# EAGLE board Accumulator Control Unit rev4 (EAGLE 9.6.2)
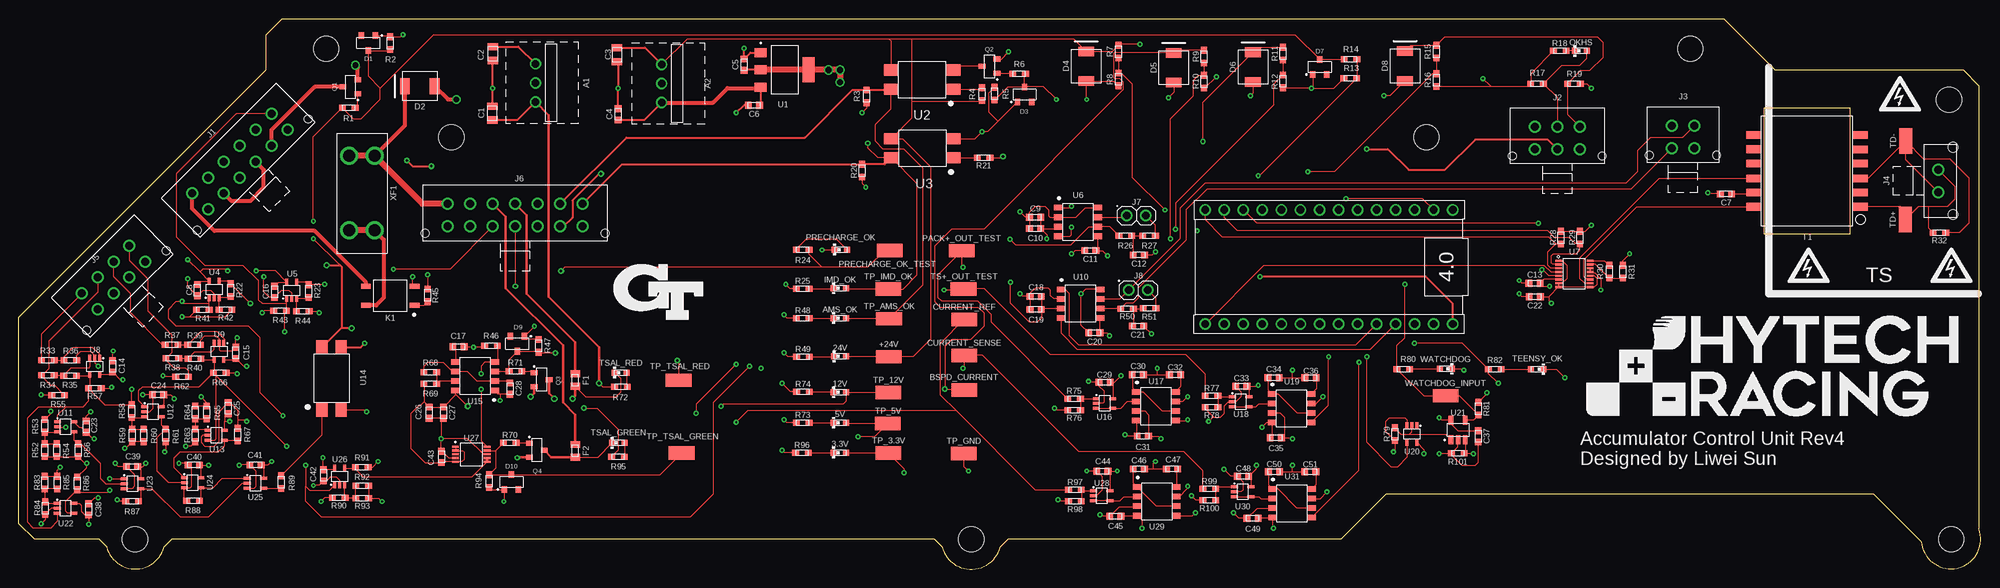
[diagram p6: board, top side]
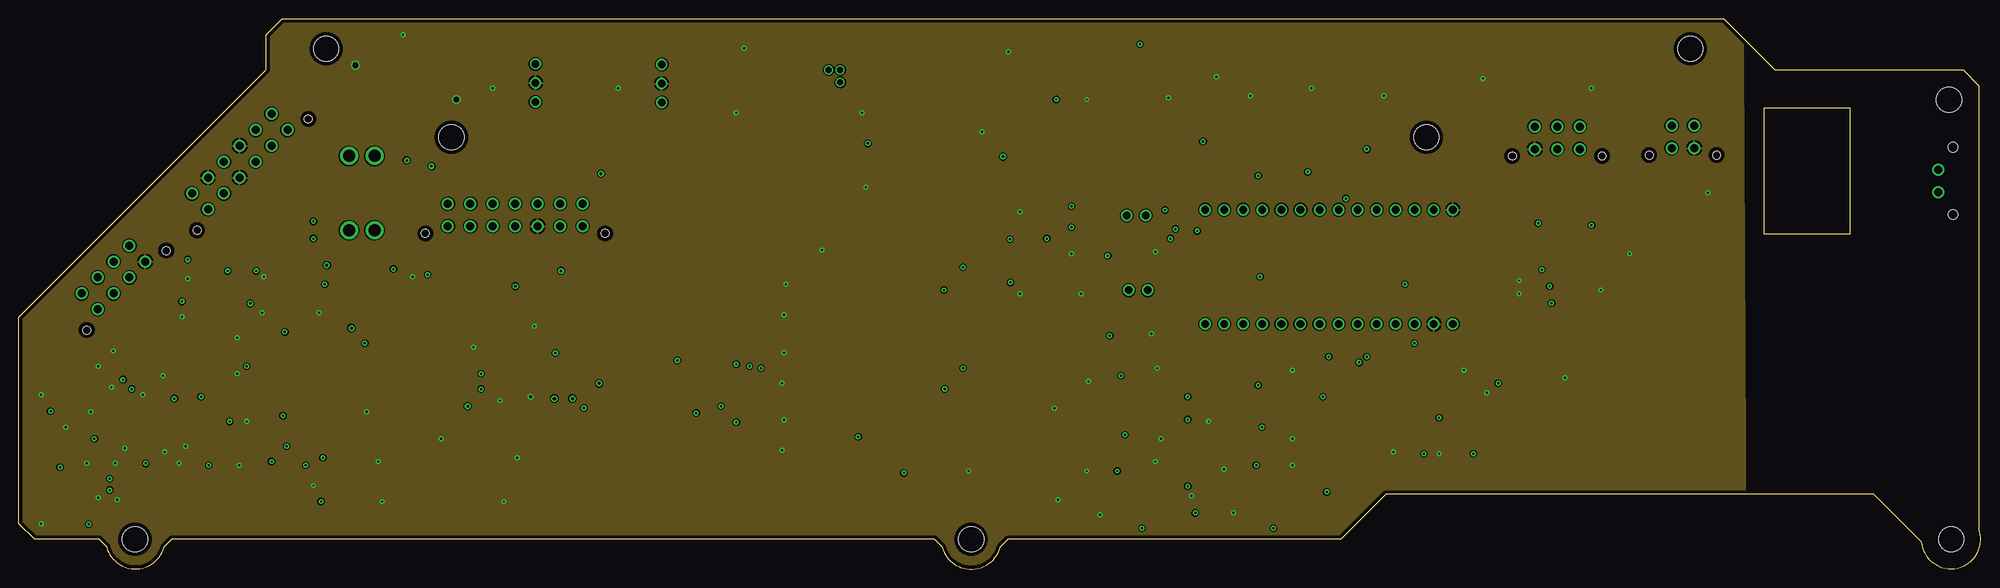
[diagram p7: board, inner layer GND]
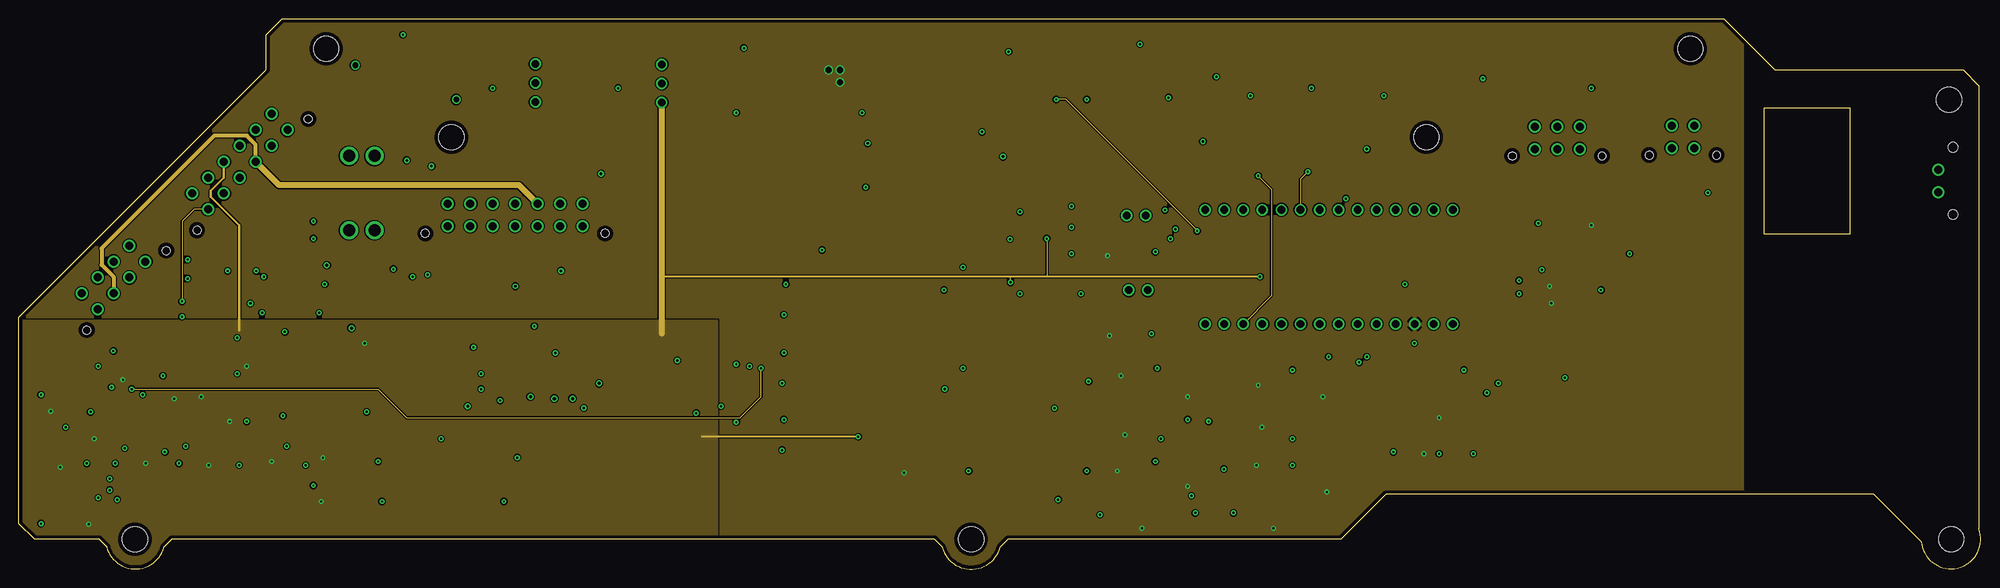
[diagram p8: board, inner layer +3V3+5V]
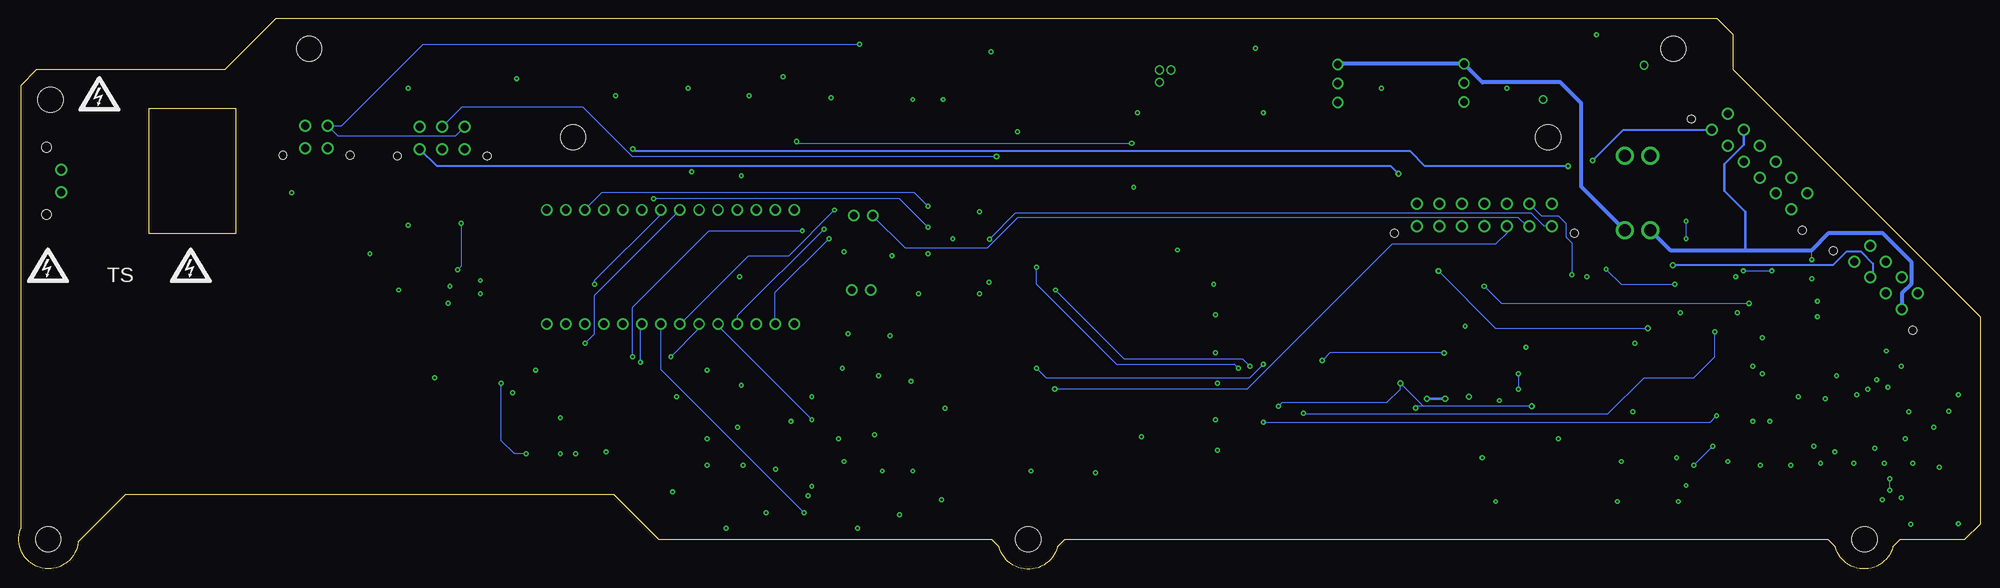
[diagram p9: board, bottom side, seen from below]

Size 261.63 x 73.39 mm. Coordinates in mm from the lower left corner, seen from the top.
Outline: 35.1,73.39 227.4,73.39 234.2,66.59 259.3,66.59 261.4,64.49 261.4,5.39 arc-195 253.7,3.69 247.4,9.99 182.3,9.99 176.3,3.99 131.9,3.99 130.9,2.99 arc-150 123.1,2.99 122.1,3.99 20.4,3.99 19.4,2.99 arc-150 11.7,2.99 10.7,3.99 2.1,3.99 0,6.09 0,33.59 33,66.59 33,71.29 35.1,73.39
Copper layers (1+2*15+16): Top 0.035mm / dielectric 0.2mm / GND 0.0175mm / dielectric 1.065mm / +3V3+5V 0.0175mm / dielectric 0.2mm / Bottom 0.035mm
Design rules "HyTech Default (4 Layer)": minimum track width 6mil, minimum drill 10mil, track to track 6mil, track to pad 6mil, pad to pad 6mil, via to via 20mil, smd to smd 6mil, copper to edge 20mil, drill to drill 21mil, minimum pad ring 8mil, minimum via ring 8mil, stop-mask expansion 3mil, vias tented up to drill 30mil, thermal gap 10mil

## Footprints (pad centres in the part's own frame; a part is rotated, then mirrored left to right if it is on the bottom)
0603-LED = smd 0.8 x 0.8: 1 -0.825,0; 2 0.825,0
OKI-78SR = drill 0.991: 1 -2.54,0; 2 0,0; 3 2.54,0
TEENSY_SHORT = drill 1.016: 3.3V 0,5.08; AGND/GND 0,2.54; D0 15.24,2.54; D1 15.24,5.08; D2 15.24,7.62; D3 15.24,10.16; D4 15.24,12.7; D5 15.24,15.24; D6 15.24,17.78; D7 15.24,20.32; D8 15.24,22.86; D9 15.24,25.4; D10 15.24,27.94; D11 15.24,30.48; D12 15.24,33.02; D13 0,33.02; D14 0,30.48; D15 0,27.94; D16 0,25.4; D17 0,22.86; D18 0,20.32; D19 0,17.78; D20 0,15.24; D21 0,12.7; D22 0,10.16; D23 0,7.62; GND 15.24,0; VIN 0,0
MICRO_MINIATURE = smd 3.429 x 1.778: 1 0,0
0805-CAP = smd 0.95 x 1.4: 1 -0.925,0; 2 0.925,0
0603-CAP = smd 0.9 x 0.9: 1 -0.75,0; 2 0.75,0
SOT-23 = smd 0.711 x 0.889: 1 -0.94,-1.003; 2 0.94,-1.003; 3 0,1.003
DO-214AA = smd 1.27 x 2.1: 1 -1.98,0; 2 1.98,0
0603-FUSE = smd 0.914 x 1.27: 1 -0.838,0; 2 0.838,0
MOLEX_MICROFIT_PTH_VERTICAL_12_DUAL = drill 1.067: 1 7.493,-2.997; 2 4.496,-2.997; 3 1.499,-2.997; 4 -1.499,-2.997; 5 -4.496,-2.997; 6 -7.493,-2.997; 7 7.493,0; 8 4.496,0; 9 1.499,0; 10 -1.499,0; 11 -4.496,0; 12 -7.493,0 | hole 1.067: 10.49,0.94; -10.49,0.94
MOLEX_MICROFIT_PTH_VERTICAL_06_DUAL = drill 1.067: 1 2.997,-2.997; 2 0,-2.997; 3 -2.997,-2.997; 4 2.997,0; 5 0,0; 6 -2.997,0 | hole 1.067: 5.994,0.94; -5.994,0.94
MOLEX_MICROFIT_PTH_VERTICAL_04_DUAL = drill 1.067: 1 1.499,-2.997; 2 -1.499,-2.997; 3 1.499,0; 4 -1.499,0 | hole 1.067: 4.496,0.94; -4.496,0.94
MOLEX_MICROFIT_PTH_VERTICAL_02_SINGLE = drill 1.067: 1 1.499,0; 2 -1.499,0 | hole 1.321: 4.496,-1.956; -4.496,-1.956
MOLEX_MICROFIT_PTH_VERTICAL_08_DUAL = drill 1.067: 1 4.496,-2.997; 2 1.499,-2.997; 3 -1.499,-2.997; 4 -4.496,-2.997; 5 4.496,0; 6 1.499,0; 7 -1.499,0; 8 -4.496,0 | hole 1.067: 7.493,0.94; -7.493,0.94
MOLEX_MICROFIT_PTH_VERTICAL_14_DUAL = drill 1.067: 1 8.992,-2.997; 2 5.994,-2.997; 3 2.997,-2.997; 4 0,-2.997; 5 -2.997,-2.997; 6 -5.994,-2.997; 7 -8.992,-2.997; 8 8.992,0; 9 5.994,0; 10 2.997,0; 11 0,0; 12 -2.997,0; 13 -5.994,0; 14 -8.992,0 | hole 1.067: 11.989,0.94; -11.989,0.94
1X02 = drill 1.016: 1 -1.27,0; 2 1.27,0
SOP-04 = smd 0.7 x 1.3: 1 -1.27,-3.25; 2 1.27,-3.25; 3 1.27,3.25; 4 -1.27,3.25
0603-RES = smd 0.9 x 0.8: 1 -0.85,0; 2 0.85,0
HM2112ZNLT_AIRGAP = smd 1.02 x 1.89: 1 -4.78,-7.145; 2 -2.89,-7.145; 3 -1,-7.145; 4 1,-7.145; 5 2.875,-7.145; 6 4.78,-7.145; 7 4.78,7.145; 8 2.89,7.145; 9 1,7.145; 10 -1,7.145; 11 -2.89,7.145; 12 -4.78,7.145
5015 = smd 3.429 x 1.778: 1 0,0
SOT-223 = smd 1.2 x 1.6: 1 -2.3,-3.2; 2 0,-3.2; 3 2.3,-3.2 | smd 3.3 x 1.6: 4 0,3.2
DIP-4 = smd 1.5 x 1.9: 1 -1.27,-4.15; 2 1.27,-4.15; 3 -1.27,4.15; 4 1.27,4.15
SC-70-5 = smd 0.4 x 0.9: 1 -0.65,-1.1; 2 0,-1.1; 3 0.65,-1.1; 4 0.65,1.1; 5 -0.65,1.1
SOIC-08(NARROW,0.15") = smd 0.762 x 1.143: 1 -1.905,-2.603; 2 -0.635,-2.603; 3 0.635,-2.603; 4 1.905,-2.603; 5 1.905,2.603; 6 0.635,2.603; 7 -0.635,2.603; 8 -1.905,2.603
MSOP-16 = smd 0.305 x 0.889: 1 -1.75,-2.106; 2 -1.25,-2.106; 3 -0.75,-2.106; 4 -0.25,-2.106; 5 0.25,-2.106; 6 0.75,-2.106; 7 1.25,-2.106; 8 1.75,-2.106; 9 1.75,2.106; 10 1.25,2.106; 11 0.75,2.106; 12 0.25,2.106; 13 -0.25,2.106; 14 -0.75,2.106; 15 -1.25,2.106; 16 -1.75,2.106
SOT-23-5 = smd 0.62 x 1.22: 1 -0.95,-1.31; 2 0,-1.31; 3 0.95,-1.31; 4 0.95,1.31; 5 -0.95,1.31
MSOP-10 = smd 0.305 x 0.889: 1 -1,-2.106; 2 -0.5,-2.106; 3 0,-2.106; 4 0.5,-2.106; 5 1,-2.106; 6 1,2.106; 7 0.5,2.106; 8 0,2.106; 9 -0.5,2.106; 10 -1,2.106
MOUNTING_M3 = hole 3.4: 0,0
3568 = drill 1.6: 1 -4.953,1.702; 2 -4.953,-1.702; 3 4.953,-1.702; 4 4.953,1.702

## Placement (x,y rotation side)
3.3V  LED_0603_GREEN  [0603-LED]  109.51,15.56 0 top
5V  LED_0603_BLUE  [0603-LED]  109.51,19.54 0 top
12V  LED_0603_RED  [0603-LED]  109.51,23.59 0 top
24V  LED_0603_ORANGE  [0603-LED]  109.51,28.37 0 top
A1  VOLTAGE_REGULATOR_MODULE_OKI-78SR_12V  [OKI-78SR]  68.91,64.83 270 top
A2  VOLTAGE_REGULATOR_MODULE_OKI-78SR_5V  [OKI-78SR]  85.74,64.76 270 top
A3  TEENSY_4.0TH  [TEENSY_SHORT]  191.24,32.68 90 top
AMS_OK  LED_0603_GREEN  [0603-LED]  109.51,33.48 0 top
BSPD_CURRENT  TEST_POINT  [MICRO_MINIATURE]  126.08,23.9 0 top
C1  CAPACITOR_0805_50V_10UF  [0805-CAP]  63.13,60.82 90 top
C2  CAPACITOR_0805_50V_10UF  [0805-CAP]  63.23,68.75 270 top
C3  CAPACITOR_0805_50V_10UF  [0805-CAP]  79.79,68.6 270 top
C4  CAPACITOR_0603_25V_10UF  [0603-CAP]  79.91,60.63 90 top
C5  CAPACITOR_0603_10V_4.7UF  [0603-CAP]  96.7,67.26 90 top
C6  CAPACITOR_0603_10V_1UF  [0603-CAP]  98.03,61.85 180 top
C7  CAPACITOR_0603_10V_10NF  [0603-CAP]  227.66,50.04 180 top
C8  CAPACITOR_0603_50V_0.1UF  [0603-CAP]  23.83,37.2 270 top
C9  CAPACITOR_0603_10V_1UF  [0603-CAP]  135.53,46.94 0 top
C10  CAPACITOR_0603_10V_0.1UF  [0603-CAP]  135.53,45.41 0 top
C11  CAPACITOR_0603_10V_0.1UF  [0603-CAP]  142.9,42.49 0 top
C12  CAPACITOR_0603_10V_4.7NF  [0603-CAP]  149.35,41.9 180 top
C13  CAPACITOR_0603_10V_10NF  [0603-CAP]  202.13,38.11 0 top
C14  CAPACITOR_0603_10V_0.1UF  [0603-CAP]  12.51,27.05 90 top
C15  CAPACITOR_0603_10V_0.1UF  [0603-CAP]  28.95,28.86 90 top
C16  CAPACITOR_0603_50V_0.1UF  [0603-CAP]  34.1,36.99 270 top
C17  CAPACITOR_0603_10V_10NF  [0603-CAP]  58.63,29.66 0 top
C18  CAPACITOR_0603_10V_1UF  [0603-CAP]  135.61,36.36 0 top
C19  CAPACITOR_0603_10V_0.1UF  [0603-CAP]  135.61,34.64 0 top
C20  CAPACITOR_0603_10V_0.1UF  [0603-CAP]  143.43,31.51 0 top
C21  CAPACITOR_0603_10V_4.7NF  [0603-CAP]  149.25,32.42 180 top
C22  CAPACITOR_0603_10V_0.1UF  [0603-CAP]  202.15,36.32 180 top
C23  CAPACITOR_0603_10V_0.1UF  [0603-CAP]  9,19.02 90 top
C24  CAPACITOR_0603_10V_0.1UF  [0603-CAP]  18.59,23.25 180 top
C25  CAPACITOR_0603_10V_0.1UF  [0603-CAP]  27.93,21.48 90 top
C26  CAPACITOR_0603_25V_0.1UF  [0603-CAP]  54.73,20.87 270 top
C27  CAPACITOR_0603_25V_1UF  [0603-CAP]  56.63,20.87 270 top
C28  CAPACITOR_0603_10V_4.7UF  [0603-CAP]  65.51,24.09 270 top
C29  CAPACITOR_0603_25V_0.1UF  [0603-CAP]  144.79,24.93 180 top
C30  CAPACITOR_0603_10V_0.1UF  [0603-CAP]  149.24,25.92 0 top
C31  CAPACITOR_0603_10V_0.1UF  [0603-CAP]  149.91,17.75 0 top
C32  CAPACITOR_0603_10V_680PF  [0603-CAP]  154.19,25.92 180 top
C33  CAPACITOR_0603_10V_0.1UF  [0603-CAP]  163.02,24.39 180 top
C34  CAPACITOR_0603_10V_0.1UF  [0603-CAP]  167.32,25.51 0 top
C35  CAPACITOR_0603_10V_0.1UF  [0603-CAP]  167.61,17.53 0 top
C36  CAPACITOR_0603_10V_680PF  [0603-CAP]  172.27,25.51 180 top
C37  CAPACITOR_0603_10V_0.1UF  [0603-CAP]  194.61,17.72 90 top
C38  CAPACITOR_0603_10V_0.1UF  [0603-CAP]  9.31,7.97 90 top
C39  CAPACITOR_0603_10V_0.1UF  [0603-CAP]  15.13,13.69 180 top
C40  CAPACITOR_0603_10V_0.1UF  [0603-CAP]  23.36,13.9 180 top
C41  CAPACITOR_0603_10V_0.1UF  [0603-CAP]  31.59,13.9 180 top
C42  CAPACITOR_0603_10V_0.1UF  [0603-CAP]  40.63,12.5 270 top
C43  CAPACITOR_0603_25V_1UF  [0603-CAP]  56.37,14.97 90 top
C44  CAPACITOR_0603_25V_0.1UF  [0603-CAP]  144.5,13.08 180 top
C45  CAPACITOR_0603_10V_0.1UF  [0603-CAP]  146.24,7.05 180 top
C46  CAPACITOR_0603_10V_0.1UF  [0603-CAP]  149.35,13.36 0 top
C47  CAPACITOR_0603_10V_680PF  [0603-CAP]  153.8,13.36 180 top
C48  CAPACITOR_0603_10V_0.1UF  [0603-CAP]  163.27,12.38 180 top
C49  CAPACITOR_0603_10V_0.1UF  [0603-CAP]  164.53,6.79 180 top
C50  CAPACITOR_0603_10V_0.1UF  [0603-CAP]  167.39,12.98 0 top
C51  CAPACITOR_0603_10V_680PF  [0603-CAP]  172.21,12.98 180 top
CURRENT_REF  TEST_POINT  [MICRO_MINIATURE]  126.08,33.3 0 top
CURRENT_SENSE  TEST_POINT  [MICRO_MINIATURE]  126.08,28.51 0 top
D1  TVS__8V  [SOT-23]  46.64,70.15 180 top
D2  TVS_DO-214AA_30V  [DO-214AA]  53.48,64.39 180 top
D3  TVS__8V  [SOT-23]  134.12,63.29 0 top
D4  TVS_DO-214AA_28V  [DO-214AA]  142.34,67.07 90 top
D5  TVS_DO-214AA_28V  [DO-214AA]  154.02,66.87 90 top
D6  TVS_DO-214AA_28V  [DO-214AA]  164.59,66.94 90 top
D7  TVS__8V  [SOT-23]  173.49,66.95 0 top
D8  TVS_DO-214AA_28V  [DO-214AA]  184.86,67.09 90 top
D9  TVS__15V  [SOT-23]  66.5,30.06 180 top
D10  TVS__15V  [SOT-23]  65.69,11.62 0 top
F1  FUSE_0603_.75A  [0603-FUSE]  74.19,25.21 270 top
F2  FUSE_0603_.75A  [0603-FUSE]  74.19,15.79 270 top
IMD_OK  LED_0603_ORANGE  [0603-LED]  109.51,37.46 0 top
J1  CONNECTOR-12_MF_T_V_  [MOLEX_MICROFIT_PTH_VERTICAL_12_DUAL]  30.53,53.28 225 top
J2  CONNECTOR-6_μF_T_V_BLACK  [MOLEX_MICROFIT_PTH_VERTICAL_06_DUAL]  205.16,56.02 180 top
J3  CONNECTOR-4_μF_T_V_BLACK  [MOLEX_MICROFIT_PTH_VERTICAL_04_DUAL]  221.92,56.15 180 top
J4  CONNECTOR-2_MF_T_V_  [MOLEX_MICROFIT_PTH_VERTICAL_02_SINGLE]  255.97,51.77 90 top
J5  CONNECTOR-8_μF_T_V_BLACK  [MOLEX_MICROFIT_PTH_VERTICAL_08_DUAL]  13.7,37.84 225 top
J6  CONNECTOR-14_MF_T_V_  [MOLEX_MICROFIT_PTH_VERTICAL_14_DUAL]  66.2,45.71 180 top
J7  JUMPER__1X02  [1X02]  149.02,47.15 0 top
J8  JUMPER__1X02  [1X02]  149.28,37.2 0 top
K1  RELAY_SOLIDSTATE_NO_CPC1020NTR  [SOP-04]  49.55,36.46 90 top
OKHS  LED_0603_YELLOW  [0603-LED]  208.31,69.09 0 top
PACK+_OUT_TEST  TEST_POINT  [MICRO_MINIATURE]  125.77,42.45 180 top
PRECHARGE_OK  LED_0603_RED  [0603-LED]  109.63,42.61 0 top
PRECHARGE_OK_TEST  TEST_POINT  [MICRO_MINIATURE]  116.15,42.49 180 top
Q1  TRANSISTOR_N_MOS__PMV15ENEA  [SOT-23]  44.21,64.32 90 top
Q2  TRANSISTOR_N_MOS__PMV15ENEA  [SOT-23]  129.46,67.06 90 top
Q3  TRANSISTOR_N_MOS__PMV15ENEA  [SOT-23]  69.72,25.26 270 top
Q4  TRANSISTOR_N_MOS__PMV15ENEA  [SOT-23]  69.09,15.86 270 top
R1  RESISTOR_0603_10  [0603-RES]  44,61.54 0 top
R2  RESISTOR_0603_10K  [0603-RES]  49.55,70.12 90 top
R3  RESISTOR_0603_20K  [0603-RES]  113.06,63.04 90 top
R4  RESISTOR_0603_5.1K  [0603-RES]  128.45,63.34 270 top
R5  RESISTOR_0603_10K  [0603-RES]  130.15,63.4 90 top
R6  RESISTOR_0603_10  [0603-RES]  133.39,66.05 180 top
R7  RESISTOR_0603_36.5K  [0603-RES]  146.64,69 270 top
R8  RESISTOR_0603_4.64K  [0603-RES]  146.64,65.29 270 top
R9  RESISTOR_0603_36.5K  [0603-RES]  158.02,68.34 270 top
R10  RESISTOR_0603_4.64K  [0603-RES]  158.02,65.01 270 top
R11  RESISTOR_0603_36.5K  [0603-RES]  168.56,68.75 270 top
R12  RESISTOR_0603_4.64K  [0603-RES]  168.56,65.04 270 top
R13  RESISTOR_0603_  [0603-RES]  177.58,65.47 180 top
R14  RESISTOR_0603_18.7K  [0603-RES]  177.6,68.02 0 top
R15  RESISTOR_0603_  [0603-RES]  189.01,69.02 270 top
R16  RESISTOR_0603_5.1K  [0603-RES]  189.03,65.21 270 top
R17  RESISTOR_0603_2.2K  [0603-RES]  202.46,64.73 0 top
R18  RESISTOR_0603_2K  [0603-RES]  205.48,69.09 0 top
R19  RESISTOR_0603_2.2K  [0603-RES]  207.38,64.74 180 top
R20  RESISTOR_0603_20K  [0603-RES]  112.42,53.13 90 top
R21  RESISTOR_0603_5.1K  [0603-RES]  128.68,54.87 180 top
R22  RESISTOR_0603_10.5K  [0603-RES]  28.27,37.2 90 top
R23  RESISTOR_0603_10.5K  [0603-RES]  38.67,37.06 90 top
R24  RESISTOR_0603_1K  [0603-RES]  104.53,42.58 0 top
R25  RESISTOR_0603_2K  [0603-RES]  104.53,37.41 0 top
R26  RESISTOR_0603_60.4  [0603-RES]  147.57,44.44 180 top
R27  RESISTOR_0603_60.4  [0603-RES]  150.72,44.49 0 top
R28  RESISTOR_0603_2K  [0603-RES]  205.65,44.22 90 top
R29  RESISTOR_0603_2K  [0603-RES]  208.19,44.22 90 top
R30  RESISTOR_0603_1K  [0603-RES]  212.08,39.67 270 top
R31  RESISTOR_0603_1K  [0603-RES]  213.88,39.68 90 top
R32  RESISTOR_0603_120  [0603-RES]  256.11,44.88 180 top
R33  RESISTOR_0603_10.5K  [0603-RES]  3.89,27.83 0 top
R34  RESISTOR_0603_10.5K  [0603-RES]  3.89,25.85 0 top
R35  RESISTOR_0603_13K  [0603-RES]  6.86,25.82 0 top
R36  RESISTOR_0603_13K  [0603-RES]  6.88,27.83 0 top
R37  RESISTOR_0603_10.5K  [0603-RES]  20.4,29.94 0 top
R38  RESISTOR_0603_10.5K  [0603-RES]  20.47,28.11 0 top
R39  RESISTOR_0603_13K  [0603-RES]  23.39,29.94 0 top
R40  RESISTOR_0603_13K  [0603-RES]  23.44,28.08 0 top
R41  RESISTOR_0603_100K  [0603-RES]  24.56,34.58 0 top
R42  RESISTOR_0603_2.74K  [0603-RES]  27.58,34.58 180 top
R43  RESISTOR_0603_100K  [0603-RES]  34.84,34.46 0 top
R44  RESISTOR_0603_2.74K  [0603-RES]  37.86,34.42 180 top
R45  RESISTOR_0603_10K  [0603-RES]  54.51,36.51 270 top
R46  RESISTOR_0603_10K  [0603-RES]  62.98,29.83 0 top
R47  RESISTOR_0603_10K  [0603-RES]  69.32,29.78 90 top
R48  RESISTOR_0603_2K  [0603-RES]  104.53,33.47 0 top
R49  RESISTOR_0603_3.3K  [0603-RES]  104.56,28.32 0 top
R50  RESISTOR_0603_60.4  [0603-RES]  147.8,34.76 180 top
R51  RESISTOR_0603_60.4  [0603-RES]  150.8,34.76 0 top
R52  RESISTOR_0603_DNP  [0603-RES]  3.49,15.87 90 top
R53  RESISTOR_0603_11.5K  [0603-RES]  3.49,19.11 90 top
R54  RESISTOR_0603_5.9K  [0603-RES]  5.06,15.87 90 top
R55  RESISTOR_0603_10K  [0603-RES]  5.24,23.2 0 top
R56  RESISTOR_0603_10K  [0603-RES]  7.9,15.88 90 top
R57  RESISTOR_0603_10K  [0603-RES]  10.13,24.14 180 top
R58  RESISTOR_0603_36.5K  [0603-RES]  15.05,21.08 90 top
R59  RESISTOR_0603_330K  [0603-RES]  15.11,17.84 90 top
R60  RESISTOR_0603_DNP  [0603-RES]  16.66,17.84 90 top
R61  RESISTOR_0603_10K  [0603-RES]  19.59,17.84 90 top
R62  RESISTOR_0603_10K  [0603-RES]  21.79,25.64 0 top
R63  RESISTOR_0603_14K  [0603-RES]  23.53,17.85 90 top
R64  RESISTOR_0603_DNP  [0603-RES]  23.54,20.92 90 top
R65  RESISTOR_0603_1K  [0603-RES]  25.09,20.92 90 top
R66  RESISTOR_0603_10K  [0603-RES]  26.8,26.2 180 top
R67  RESISTOR_0603_10K  [0603-RES]  29.19,17.94 270 top
R68  RESISTOR_0603_43K  [0603-RES]  54.88,26.24 0 top
R69  RESISTOR_0603_10K  [0603-RES]  54.88,24.72 180 top
R70  RESISTOR_0603_10  [0603-RES]  65.48,16.85 0 top
R71  RESISTOR_0603_10  [0603-RES]  66.24,26.38 0 top
R72  RESISTOR_0603_2K  [0603-RES]  80.29,24.32 0 top
R73  RESISTOR_0603_1K  [0603-RES]  104.53,19.54 0 top
R74  RESISTOR_0603_2K  [0603-RES]  104.56,23.65 0 top
R75  RESISTOR_0603_10K  [0603-RES]  140.73,22.75 0 top
R76  RESISTOR_0603_12K  [0603-RES]  140.73,21.22 180 top
R77  RESISTOR_0603_10K  [0603-RES]  159.07,23.1 0 top
R78  RESISTOR_0603_12K  [0603-RES]  159.07,21.58 180 top
R79  RESISTOR_0603_10K  [0603-RES]  183.48,18.01 90 top
R80  RESISTOR_0603_470  [0603-RES]  184.64,26.69 180 top
R81  RESISTOR_0603_10K  [0603-RES]  194.67,21.42 270 top
R82  RESISTOR_0603_470  [0603-RES]  196.83,26.64 180 top
R83  RESISTOR_0603_1K  [0603-RES]  3.49,11.55 90 top
R84  RESISTOR_0603_14K  [0603-RES]  3.51,8.16 90 top
R85  RESISTOR_0603_DNP  [0603-RES]  5.14,11.55 90 top
R86  RESISTOR_0603_10K  [0603-RES]  7.82,11.45 270 top
R87  RESISTOR_0603_10K  [0603-RES]  15.1,9.06 0 top
R88  RESISTOR_0603_10K  [0603-RES]  23.24,9.16 0 top
R89  RESISTOR_0603_470  [0603-RES]  34.99,11.63 90 top
R90  RESISTOR_0603_73.2K  [0603-RES]  42.67,9.54 180 top
R91  RESISTOR_0603_10K  [0603-RES]  45.75,13.6 180 top
R92  RESISTOR_0603_1M  [0603-RES]  45.8,11.14 180 top
R93  RESISTOR_0603_8.66K  [0603-RES]  45.8,9.48 180 top
R94  RESISTOR_0603_10K  [0603-RES]  62.71,11.75 270 top
R95  RESISTOR_0603_2K  [0603-RES]  79.91,15 0 top
R96  RESISTOR_0603_1K  [0603-RES]  104.43,15.52 0 top
R97  RESISTOR_0603_10K  [0603-RES]  140.85,10.57 0 top
R98  RESISTOR_0603_12K  [0603-RES]  140.85,9.05 180 top
R99  RESISTOR_0603_10K  [0603-RES]  158.75,10.7 0 top
R100  RESISTOR_0603_12K  [0603-RES]  158.75,9.17 180 top
R101  RESISTOR_0603_10K  [0603-RES]  191.9,15.46 0 top
T1  TRANSFORMER_HM2112ZNLT_AIRGAP  [HM2112ZNLT_AIRGAP]  238.46,53.1 90 top
TD+  TEST_POINT  [MICRO_MINIATURE]  251.58,46.61 90 top
TD-  TEST_POINT  [MICRO_MINIATURE]  251.63,57.1 90 top
TEENSY_OK  LED_0603_RED  [0603-LED]  202.5,26.68 180 top
TP_3.3V  TEST_POINT  [5015]  115.96,15.49 0 top
TP_5V  TEST_POINT  [5015]  115.9,19.44 0 top
TP_12V  TEST_POINT  [5015]  115.94,23.56 0 top
TP_24V  TEST_POINT  [5015]  116,28.33 0 top
TP_AMS_OK  TEST_POINT  [MICRO_MINIATURE]  116.06,33.39 0 top
TP_GND  TEST_POINT  [5015]  126.01,15.44 0 top
TP_IMD_OK  TEST_POINT  [MICRO_MINIATURE]  115.94,37.36 0 top
TP_TSAL_GREEN  TEST_POINT  [MICRO_MINIATURE]  88.39,15.48 180 top
TP_TSAL_RED  TEST_POINT  [MICRO_MINIATURE]  87.99,25.19 180 top
TS+_OUT_TEST  TEST_POINT  [MICRO_MINIATURE]  125.97,37.37 180 top
TSAL_GREEN  LED_0603_GREEN  [0603-LED]  79.93,16.83 0 top
TSAL_RED  LED_0603_RED  [0603-LED]  80.26,26.23 0 top
U1  VOLTAGE_REGULATOR_SOT-223_3.3V  [SOT-223]  102.14,66.58 270 top
U2  RELAY_SOLIDSTATE_NO_DIP-4  [DIP-4]  120.47,65.27 90 top
U3  RELAY_SOLIDSTATE_NO_DIP-4  [DIP-4]  120.5,56.12 90 top
U4  OPAMP_1_CHANNEL_OPA991  [SC-70-5]  26.06,37.3 0 top
U5  OPAMP_1_CHANNEL_OPA991  [SC-70-5]  36.38,37.19 0 top
U6  TCAN1051HQV-Q1  [SOIC-08(NARROW,0.15")]  141.25,46.3 270 top
U7  LTC6820  [MSOP-16]  207.43,39.38 270 top
U8  OPAMP_1_CHANNEL_OPA991  [SC-70-5]  10.14,27.05 180 top
U9  OPAMP_1_CHANNEL_OPA991  [SC-70-5]  26.71,29.05 180 top
U10  TCAN1051HQV-Q1  [SOIC-08(NARROW,0.15")]  141.61,35.4 270 top
U11  OPAMP_1_CHANNEL_OPA991  [SC-70-5]  6.26,18.99 270 top
U12  OPAMP_1_CHANNEL_OPA991  [SC-70-5]  17.9,21.01 270 top
U13  OPAMP_1_CHANNEL_OPA991  [SC-70-5]  26.33,17.86 270 top
U14  RELAY_SOLIDSTATE_NO_DIP-4  [DIP-4]  41.71,25.43 0 top
U15  LM555  [SOIC-08(NARROW,0.15")]  60.85,25.73 90 top
U16  OPAMP_1_CHANNEL_OPA991  [SC-70-5]  144.79,22.11 270 top
U17  MAX7404  [SOIC-08(NARROW,0.15")]  151.65,21.73 270 top
U18  OPAMP_1_CHANNEL_OPA991  [SC-70-5]  162.95,22.34 270 top
U19  MAX7404  [SOIC-08(NARROW,0.15")]  169.73,21.45 270 top
U20  LOGICGATE_BUFFER  [SC-70-5]  185.77,18.01 180 top
U21  ADM8316WBX30  [SOT-23-5]  191.93,18.56 0 top
U22  OPAMP_1_CHANNEL_OPA991  [SC-70-5]  6.24,8.12 270 top
U23  LOGICGATE_AND_DCK3  [SC-70-5]  15.15,11.4 270 top
U24  LOGICGATE_AND_DCK3  [SC-70-5]  23.18,11.54 270 top
U25  LOGICGATE_AND_DCK3  [SC-70-5]  31.56,11.45 270 top
U26  OPAMP_1_CHANNEL_OPA991  [SC-70-5]  42.79,12.35 0 top
U27  ADG1423  [MSOP-10]  60.34,15.32 270 top
U28  OPAMP_1_CHANNEL_OPA991  [SC-70-5]  144.4,9.81 270 top
U29  MAX7404  [SOIC-08(NARROW,0.15")]  151.77,9.05 270 top
U30  OPAMP_1_CHANNEL_OPA991  [SC-70-5]  163.2,10.32 270 top
U31  MAX7404  [SOIC-08(NARROW,0.15")]  169.8,8.79 270 top
U$1  [MOUNTING_M3]  41,69.39 0 top
U$2  [MOUNTING_M3]  222.9,69.39 0 top
U$3  [HV_MEDIUM]  250.88,63.39 0 top
U$4  [MOUNTING_M3]  257.4,62.59 0 top
U$5  [MOUNTING_M3]  57.7,57.59 0 top
U$6  [MOUNTING_M3]  187.7,57.59 0 top
U$7  [LOGO_GT_MEDIUM]  85.27,36.97 0 top
U$8  [HV_MEDIUM]  238.68,40.53 0 top
U$9  [TS]  248.08,39.26 0 top
U$10  [HV_MEDIUM]  257.73,40.53 0 top
U$11  [LOGO_HYTECH_LARGE]  208.97,20.46 0 top
U$12  [MOUNTING_M3]  15.5,3.99 0 top
U$13  [MOUNTING_M3]  127,3.99 0 top
U$14  [MOUNTING_M3]  257.7,3.99 0 top
U$15  [HV_MEDIUM]  257.73,40.53 0 bottom
U$16  [HV_MEDIUM]  238.68,40.53 0 bottom
U$17  [HV_MEDIUM]  250.88,63.39 0 bottom
WATCHDOG  LED_0603_BLUE  [0603-LED]  190.3,26.73 180 top
WATCHDOG_INPUT  TEST_POINT  [MICRO_MINIATURE]  190.27,23.14 0 top
XF1  FUSE_HOLDER_MINIBLADEPTH  [3568]  45.74,50.15 270 top

## Tracks (layer width: path | path; a pad name or v marks a point on that pad's centre or on a via)
0.90X_DIV
  Top 0.152: R60.2 R59.2 15.05,18.74 R58.1 16.67,20.23 U12.3
0.525V_DIV
  Top 0.152: R92.2 R93.2 44.9,9.54 R90.1 43.44,9.62 U26.3
3.305V_DIV
  Top 0.152: R54.2 R52.2 R53.1 5.08,18.26 U11.3
4.66V_DIV_A
  Top 0.152: R65.1 R64.1 R63.2 23.65,18.57 25.17,18.57 U13.1
4.66V_DIV_B
  Top 0.152: R85.1 R83.1 3.49,9.04 R84.2 3.75,8.77 U22.1
24V_SCALED_3.3V  (via drill 0.25)
  Top 0.152: R7.2 R8.1 147.03,66.14 148.51,64.66 148.51,52.21 v152.83,47.89
  Bottom 0.152: A3.D19 164.34,41.8 158.93,41.8 v152.83,47.89
24VIN
  Top 0.508: XF1.1 51.5,59.16 D2.2
  Top 0.813: J6.1 53.83,48.71 XF1.1 XF1.2
60V_THRESHOLD
  Top 0.152: U26.4 44.74,13.45 R91.2 44.9,13.33 45.9,12.33 60.46,12.33 U27.6
  Top 0.305: U27.6 U27.7
+3V3  (via drill 0.25, 0.81)
  Top 0.152: U7.8 U7.7 205.81,38.13 206.43,38.75 206.43,40.53 205.82,41.13 U7.1 | U7.8 U7.9 210.13,37.63 210.49,37.99 210.49,38.75 210.11,39.13 U7.12 | U7.6 203.4,38.63 C13.2 203.26,37.73 v204.14,37.73 | C22.1 204.02,36.32 | U7.8 204.02,36.32 | 204.02,36.32 204.02,35.82 v204.39,35.45 | U10.5 144.18,33.46 C20.2 145.08,31.51 v145.47,31.13 | U6.5 143.85,42.69 C11.2 144.52,42.49 v145.21,41.8 | C35.1 167.13,17.79 U19.4 166.4,19.55 v165.79,18.94 | C45.1 149.07,7.05 U29.4 149.78,6.52 v149.78,5.47 | C49.1 167.1,6.79 U31.4 167.2,5.59 v167.31,5.47 | C37.2 191.91,18.47 190.98,19.39 U21.5 189.75,19.87 v189.41,20.21 | 3.3V.2 110.41,15.49 TP_3.3V.1 118.03,13.41 v118.03,12.84 | U17.4 149.05,17.87 C31.1 147.66,17.75 v147.5,17.92 | U16.5 145.89,24.58 C29.1 146.13,24.93 v146.99,25.79 | U30.5 164.3,12.1 C48.1 165.02,13.38 v165.02,13.86 | U28.5 145.5,12.83 C44.1 146.47,13.08 v146.48,13.09 | U17.7 155.25,22.36 v155.88,23 | U31.7 173.55,9.43 v174.42,10.3 | U20.5 187.38,15.96 v187.38,15.38 | U18.5 164.05,24.11 C33.1 165.15,24.39 v165.28,24.52 | U29.7 154.75,9.68 155.88,10.81 v155.88,11.06 | U19.7 173,22.09 v173.91,23 | R28.2 R29.2 208.93,45.07 v209.73,45.86
  Top 0.254: U1.2 96.77,66.58 C5.1
  Top 0.813: v109.53,64.91 v109.53,66.56 v108,66.56 105.36,66.56 U1.4 U1.2
  pour +3V3+5V (rank 2): -6.43,76.85 229.79,76.85 229.79,-14.34 -6.43,-14.34
+5V  (via drill 0.25)
  Top 0.152: C9.2 C10.2 | C10.2 138.39,45.41 U6.3 | C19.2 136.48,34.76 U10.3 | C18.2 C19.2 | U8.5 12.16,25.95 C14.1 13.52,25.29 v13.89,25.29 | U11.5 8.07,18.94 8.33,18.94 C23.1 9.86,17.41 v10.08,17.41 | R83.2 R85.2 5.14,13.23 v5.51,13.6 | U22.5 8.05,8.77 8.31,8.52 8.31,7.76 8.84,7.22 C38.1 v9.31,5.99 v9.32,5.98 | U12.5 19.34,22 C24.1 20.25,23.25 v20.75,22.75 | U9.5 28.79,27.95 C15.1 29.99,27.06 v30.4,27.06 | 5V.2 110.43,19.44 TP_5V.1 114.12,17.67 v111.94,17.67 | R64.2 R65.2 25.09,22.22 v24.31,23 | C25.1 27.43,20.23 27.43,19.7 | U13.5 27.43,19.7 | U24.5 24.28,13.73 C40.1 24.15,13.86 v25.32,13.86 | R53.2 4.24,20.71 v4.24,21.07 | R90.2 40.82,9.54 v40.31,9.03 | U26.5 41.94,13.25 C42.1 40.56,13.32 v40.56,14.87 | C19.2 136.36,33.45 135.81,32.91 134.8,32.91 132.26,35.45 v132.26,38.24 | C10.2 137.08,44.61 v137.08,44.08 | U25.5 32.66,13.57 C41.1 33.24,13.9 v33.71,14.36 | U23.5 16.25,13.32 C39.1 16.53,13.69 v16.94,14.11 | 27.43,19.7 v28.12,19.7
  Top 0.254: U1.3 98.94,64.15 98.94,62.02 C6.1 | A2.3 83.4,59.88 C4.1 | U14.4 45.62,29.58 v46.15,30.11 | A3.VIN 191.23,35.4 187.63,39 v165.53,39
  Top 0.508: A2.3 92.57,62.22 94.5,64.15 98.94,64.15
  +3V3+5V 0.152: v132.26,38.24 132.26,39 | v137.08,44.08 137.08,39
  +3V3+5V 0.254: v165.53,39 137.08,39 132.26,39 85.74,39 | v111.94,17.67 91.11,17.67
  +3V3+5V 0.305: J1.3 27.35,52.21 25.58,50.43 25.58,49.67 29.39,45.86 29.39,31.89
  +3V3+5V 0.813: A2.3 85.74,39 85.74,31.42
  pour +3V3+5V: -6.93,33.16 93.14,33.16 93.14,-4.94 -6.93,-4.94
+12V  (via drill 0.25, 0.3, 0.35, 0.41)
  Top 0.152: 58.25,23.35 58.25,23.24 C27.1 C26.1 54.03,22.32 | U27.1 U27.2 59.17,15.82 59.36,15.63 59.36,14.62 59.06,14.32 U27.5 58.21,14.34 56.5,14.34 C43.1 54.17,14.22 52.25,16.14 52.25,20.71 53.26,21.73 53.44,21.73 54.03,22.32 | v77.39,24.78 77.85,24.32 R72.1 | v59.87,21.73 58.25,23.35 | 58.25,23.35 U15.8 | R95.1 79.93,15.87 79.93,18.68 77.14,21.48 v75.36,21.48 | TP_12V.1 110.37,23.56 12V.2 110.34,22.41 109.91,21.98 93.9,21.98 v93.65,21.73 | R69.2 54.03,22.32
  Top 0.254: C1.1 66.51,59.89 A1.3
  Top 0.305: A1.3 70.66,60.54 70.66,36.33 77.39,29.6 v77.39,24.78
  Bottom 0.152: 74.35,21.73 v77.39,24.78 77.39,24.02 79.17,22.24 93.14,22.24 v93.65,21.73 | v59.87,21.73 74.35,21.73 | 74.35,21.73 75.11,21.73 v75.36,21.48
+24V  (via drill 0.25)
  Top 0.152: C8.1 24.28,38.4 U4.5 24.18,39.63 | C16.1 34.65,38.29 U5.5 34.25,39.76 v31.67,39.76 | A2.1 89.2,70.75 116,70.75 | 116,70.75 119.05,70.75 | 119.05,70.75 140.64,70.75 D4.2 145.84,69.05 R7.1 146.78,69.99 v149.53,69.99 | 116,70.75 116.32,70.43 U2.4 | 119.05,70.75 119.05,62.37 | 119.05,62.37 119.05,60.09 U3.4 117.88,57.39 121.59,53.68 121.59,30.68 119.24,28.33 TP_24V.1 110.37,28.33 24V.2 | 119.05,62.37 128.34,62.37 R4.2 | 24.18,39.63 v22.53,41.28 v22.53,41.29 | v27.86,39.76 27.61,40.02 24.56,40.02 24.18,39.63
  Top 0.254: C3.1 83.51,69.52 A2.1 | C2.1 66.61,69.67 A1.1
  Top 0.508: XF1.4 48.69,43.94 48.69,36.21 47.68,35.19 K1.4
  Top 0.813: XF1.4 XF1.3
  Bottom 0.152: v149.53,69.99 207.7,69.99 218.54,59.14 J3.1 219.07,57.8 203.38,57.8 J2.1 | v31.67,39.76 v27.86,39.76 | v22.53,41.29 22.53,42.56
  Bottom 0.305: 31.42,42.56 31.42,47.64 34.21,50.43 34.21,53.99 31.59,56.61 J1.5
  Bottom 0.508: XF1.4 53.26,51.02 53.26,62.12 56.06,64.91 66.45,64.91 A1.1 85.67,67.37 A2.1 | XF1.3 41.4,42.56 31.42,42.56 22.53,42.56 20.24,44.84 13.13,44.84 9.28,41 9.28,38.02 10.52,36.78 J5.5
ACCUMULATOR_GND  (via drill 0.35)
  Top 0.254: v51.74,54.5 52.5,53.73 v55.04,53.73 | v179.76,56.02 182.55,56.02 185.34,53.23 190.17,53.23 194.23,57.29 203.89,57.29 J2.5
  Bottom 0.254: v51.74,54.5 47.66,58.57 37.52,58.57 37.35,58.57 J1.12 | v55.04,53.73 74.09,53.73 76.12,55.77 179.5,55.77 v179.76,56.02
AIR2-
  Top 0.508: Q1.3 39.47,64.32 33.71,58.56 J1.11
AMS_OK
  Top 0.152: AMS_OK.2 110.42,33.39 TP_AMS_OK.1 120.57,37.9 120.57,53.48 118.03,56.02 115.24,56.02 114.22,57.04 114.22,59.32 116.32,61.42 U2.3
  Top 0.254: U2.3 116.22,63.89 R3.2 111.18,63.89 104.83,57.54 81.03,57.54 J6.6
AMS_OK_3.3V  (via drill 0.25)
  Top 0.152: D3.3 134.12,65.93 R6.1 | R5.1 131.9,64.3 D3.3 | D3.3 136.68,64.3 v138.35,62.62 | U20.4 185.12,14.9 183.82,13.6 183.06,13.6 179.76,16.9 v179.76,28.33
  +3V3+5V 0.152: v157.15,45.1 139.62,62.62 v138.35,62.62
  Bottom 0.152: v179.76,28.33 179.76,34.94 169.6,45.1 v157.15,45.1
BSPD_CURRENT  (via drill 0.25, 0.3)
  Top 0.152: U5.4 38.29,38.29 R23.2 40.74,37.91 v40.82,37.99 | J6.10 57.51,40.02 v49.96,40.02 | BSPD_CURRENT.1 125.96,24.02 v123.5,24.02 123.5,29.73 124.38,30.62 126.92,30.62 128.7,32.4 128.7,34.18 127.94,34.94 122.86,34.94 122.1,35.7 122.1,43.07 124.38,45.35 128.72,45.35 147.26,63.9 147.26,64.99 146.79,65.46 146.14,65.46 146.01,65.6 146.01,68.69 146.14,68.83 154.01,68.83 D5.2 154.37,69.19 R9.1
  Bottom 0.152: v49.96,40.02 47.93,37.99 v40.82,37.99 | J6.10 63.2,44.81 64.69,43.32 78.54,43.32 97.84,24.02 v123.5,24.02
BSPD_CURRENT_REF  (via drill 0.3)
  Top 0.152: U4.4 27.91,38.4 R22.2 30.87,35.45 v30.91,35.45 | J6.11 66.2,37.75 v66.22,37.73
  Bottom 0.152: v66.22,37.73 63.93,35.45 v30.91,35.45
BSPD_CURRENT_TEENSY  (via drill 0.25)
  Top 0.152: v153.59,44.08 153.59,60.08 156.64,63.13 156.64,65.16 157.34,65.86 R10.1 R9.2
  Bottom 0.152: A3.D14 160.75,36.92 v153.59,44.08
CANH
  Top 0.152: U6.7 147.53,46.94 J7.1
  Bottom 0.152: J6.9 60.48,45.71 61.65,46.88 128.45,46.88 132.51,42.81 143.41,42.81 J7.1
CANH/1.3B
  Top 0.152: R27.2 151.57,45.87 J7.2
CANL  (via drill 0.25)
  Top 0.152: R26.2 145.5,45.67 U6.6 142.73,45.67 140.34,43.28 132.91,43.28 v132.18,44
  Bottom 0.152: J6.8 58.23,45.71 59.95,47.43 128.75,47.43 v132.18,44
CHASSIS_GND  (via drill 0.35)
  Top 0.254: v77.65,52.72 77.39,52.72 73.84,49.16 73.84,46.88 72.68,45.71 J6.13
  Bottom 0.254: v77.65,52.72 78.66,53.73 205.87,53.73 J2.6
CS_LTC_6820  (via drill 0.25)
  Top 0.152: U7.5 204.01,39.13 203.23,39.92 v203.12,39.92 | v202.62,46.11 165.1,46.11 A3.D10
  Bottom 0.152: v203.12,39.92 202.62,40.42 v202.62,46.11
CURRENT  (via drill 0.25)
  Top 0.152: 35.73,35.45 35.73,34.5 R43.2 35.48,34.25 v35.48,31.64 | 35.73,35.45 U5.1 | R99.1 157.9,13.1 155.37,15.63 141.4,15.63 128.53,28.51 CURRENT_SENSE.1 126.08,26.98 v125.91,26.81 | J1.6 28.98,60.69 21.01,52.72 21.01,44.34 24.82,40.53 29.9,40.53 31.93,38.49 31.93,35.95 32.44,35.45 35.73,35.45 | v95.68,27.32 90.35,21.98 v90.35,20.82
  Bottom 0.152: v125.91,26.81 124.64,25.54 97.46,25.54 v95.68,27.32 | v90.35,20.82 90.25,20.71 49.71,20.71 44.88,25.54 38.28,25.54 35.48,28.33 v35.48,31.64
CURRENT_BUFFER
  Top 0.152: U31.2 165.64,9.43 165.4,9.67 U30.4 U30.3
CURRENT_FILTERED  (via drill 0.25)
  Top 0.152: U31.5 173.06,7.55 173.07,7.55 178.74,13.22 v178.74,27.57
  Bottom 0.152: v178.74,27.57 178.74,32.47 A3.D21
CURRENT_REF  (via drill 0.25)
  Top 0.152: R41.2 25.41,35.45 | 25.41,35.45 U4.1 | CURRENT_REF.1 122.86,30.09 122.86,23.25 125.02,21.09 | R97.1 135.54,10.57 125.02,21.09 | 25.41,35.45 22.02,35.45 v21.77,35.7 21.01,35.7 19.99,34.68 19.99,33.41 21.01,32.4 30.66,32.4 32.18,30.87 32.18,23.51 v35.23,20.46 | 125.02,21.09 97.18,21.09 v95.68,19.6
  +3V3+5V 0.152: J1.7 23.38,47.98 21.77,46.37 v21.77,35.7
  Bottom 0.152: v95.68,19.6 36.09,19.6 v35.23,20.46
CURRENT_REF_BUFFER
  Top 0.152: U29.2 147.39,9.68 146.86,9.16 U28.4 U28.3
CURRENT_REF_FILTERED  (via drill 0.25)
  Top 0.152: U29.5 156.53,7.14 v156.9,7.51
  Bottom 0.152: v156.9,7.51 175.99,26.6 A3.D20
EM_CANH
  Top 0.152: U10.7 146.84,36.03 J8.1 154.86,44.06 154.86,48.15 158.17,51.45 214.3,51.45 215.82,52.97 215.82,55.77 217.6,57.54 221.82,57.54 J3.2
EM_CANL
  Top 0.152: U10.6 R50.2 147.64,35.45 148.61,35.45 149.28,36.12 149.28,37.48 155.63,43.83 155.63,47.89 158.42,50.69 214.96,50.69 J3.3
EM_CRX
  Top 0.152: U10.4 139,31.49 141.15,29.35 180.26,29.35 183.59,32.68 A3.D23
EM_CTX
  Top 0.152: A3.D22 178.25,29.86 141.4,29.86 140.13,31.13 140.13,36.72 139.55,37.3 U10.1
GND  (via drill 0.25, 0.3, 0.41, 0.76)
  Top 0.152: C13.1 200.46,38.11 v200.08,38.49 | C22.2 200.47,36.32 v200.08,36.72 | U7.14 U7.13 209.66,39.51 210.16,39.51 211,38.67 v211,37.22 | C9.1 C10.1 | C9.1 134.23,46.94 v133.53,47.64 | C18.1 C19.1 | C18.1 133.88,36.36 v133.53,36.72 | C21.1 v151.04,31.38 v151.05,31.38 | v10.59,27.06 10.14,27.51 U8.2 10.14,28.47 9.57,29.04 8.25,29.04 7.73,28.52 R36.2 | C26.2 C27.2 56.31,19.8 v56.31,17.41 | C14.2 12.51,28.98 v12.62,29.1 | C23.2 9,20.39 v9.58,20.97 | v16.54,23.25 C24.2 17.96,23.12 17.96,21.48 17.49,21.01 U12.2 | 29.19,19.95 29.19,21.17 28.12,22.23 C25.2 26.72,21.02 26.72,17.03 26.09,16.4 24.82,16.4 24.31,16.9 24.31,17.67 24.5,17.86 U13.2 | 29.19,19.95 R67.1 | 29.19,19.95 30.15,19.95 v30.4,19.7 | v21.36,14.11 22.4,14.11 C40.2 23.04,13.47 23.04,11.06 22.86,10.89 U24.3 22.08,9.47 R88.1 | R87.1 13.36,9.05 v13.13,9.28 | C38.2 10.13,9.54 v10.59,9.54 | U22.2 4.33,8.12 R84.1 3.51,6.63 v2.97,6.08 | R52.1 R54.1 R56.1 8.82,14.11 v9.07,14.11 9.07,13.55 R86.1 | U11.2 5.22,18.94 v6.27,18.94 | R55.1 3.02,23.2 v2.97,23.25 | R57.1 12.24,24.14 v12.37,24.27 | R62.1 19.38,25.64 v19.23,25.79 | R66.1 28.98,26.2 v29.13,26.05 | v29.13,30.87 28.95,30.69 C15.2 28.44,29.1 26.85,29.1 26.71,29.23 U9.2 26.71,30.75 26.34,31.13 24.82,31.13 24.24,30.56 R39.2 | U4.2 26.06,36.74 25.58,37.22 24.6,37.22 C8.2 22.53,37.75 v22.53,38.75 | R41.1 22.79,33.67 | v21.77,33.67 22.79,33.67 | 22.79,33.67 27.52,33.67 R42.1 | U5.2 36.38,36.84 35.99,37.22 35.09,37.22 C16.2 33.42,36.24 32.69,36.97 v32.69,39 | U14.2 46.09,21.28 v46.41,20.97 | R92.1 R93.1 47.98,9.48 v48.44,9.03 | R91.1 47.17,13.6 v47.93,14.36 | U26.2 42.79,11.88 42.34,12.33 41.58,12.33 41,11.75 C42.2 40.04,11.16 v39.29,11.16
  Top 0.152: R94.2 62.99,10.62 D10.1 64.75,9.08 v64.69,9.03 | U27.4 57.38,14.82 56.48,15.72 C43.2 56.31,15.78 v56.31,17.41 | U27.8 61.96,15.32 59.87,17.41 v56.31,17.41 | C17.2 60.57,29.66 v60.63,29.6 61.9,29.6 R46.1 | R47.2 67.87,30.63 D9.1 68.76,32.39 v68.76,32.4 | C28.2 64.19,23.34 | 64.19,23.34 63.94,23.34 U15.1 | 64.19,23.34 v64.19,22.49 | R96.1 102.14,15.52 v101.78,15.89 | R73.1 102.45,19.54 v102.03,19.95 | R74.1 102.9,23.65 v101.78,24.78 | R49.1 102.56,28.32 v102.03,28.84 | R48.1 102.48,33.47 v102.03,33.92 | R25.1 102.87,37.41 v102.29,37.99 | PRECHARGE_OK.1 108.76,42.56 v107.11,42.56 | R20.1 112.42,51.47 v112.95,50.94 | R3.1 113.06,61.46 v112.45,60.85 | v142.42,62.62 142.34,62.7 D4.1 145.99,65.09 R8.2 | D5.1 154.02,63.56 v153.34,62.88 | D6.1 164.59,63.46 v164.26,63.13 | D7.1 172.55,64.31 v172.39,64.15 | R12.2 172.35,64.19 v172.39,64.15 | v172.39,64.15 175.4,64.15 R13.2 | D8.1 182.88,63.13 v182.04,63.13 | R16.2 196.3,64.36 | 196.3,64.36 201.24,64.36 R17.1 201.61,66.08 R18.1 | 196.3,64.36 v195.25,65.42 | C7.2 225.36,50.04 v225.22,50.18 | R31.2 213.88,41.12 v214.81,42.05 | TEENSY_OK.1 205.04,26.67 v206.17,25.54 | v183.31,15.63 183.48,15.8 R79.1 182.3,18.35 182.3,19.7 182.8,20.21 184.84,20.21 185.12,19.92 U20.3 | R101.1 191.93,16.35 U21.2 | R101.1 190.97,15.38 v189.41,15.38 | R101.1 191.05,15.26 192.46,13.86 194.23,13.86 194.61,14.23 C37.1 | R81.1 195.76,23.36 v195.76,23.51 | WATCHDOG.1 192.54,26.73 v192.71,26.56 | U10.8 142.24,37.3 v141.66,36.72 141.66,32.54 C20.1 | U10.2 138.02,36.03 137.59,36.46 137.59,37.22 137.34,37.48 135.56,37.48 134.86,36.78 C18.1 | C9.1 134.78,47.62 135.56,48.4 136.83,48.4 137.34,47.89 137.34,47.13 137.53,46.94 U6.2 140.95,46.94 142.22,48.21 U6.8
  Top 0.152: C11.1 140.83,42.49 v140.39,42.05 | v152.32,17.41 151.98,17.75 C31.2 150.66,20.6 150.16,21.09 U17.3 | v142.67,25.03 142.77,24.93 C29.2 144.04,24.42 144.7,23.76 144.7,22.24 144.58,22.11 U16.2 | C30.2 151.82,25.92 | 151.82,25.92 C32.2 | 151.82,25.92 v151.82,26.81 | C46.2 151.31,13.36 | 151.31,13.36 C47.2 | 151.31,13.36 151.31,14.11 v151.56,14.36 | U29.3 149.02,8.27 146.72,8.27 C45.2 144.4,7.05 v144.2,7.25 | R98.2 138.85,9.05 v138.61,9.28 | U28.2 143.7,9.81 144.45,10.55 144.45,12.38 C44.2 142.43,13.08 v142.42,13.09 | C50.2 169.85,12.98 | 169.85,12.98 C51.2 | 169.85,12.98 v169.85,13.86 | v169.85,17.41 169.73,17.53 C35.2 168.83,18 168.83,20.21 168.22,20.82 U19.3 | U30.2 162.11,10.3 162.99,10.3 163.25,10.55 163.25,11.66 C48.2 161.67,12.38 v160.71,13.35 | R100.2 157.01,9.17 v156.39,9.79 | v161.98,7.51 162.69,6.79 C49.2 165.15,8.16 U31.3 | R19.1 209.13,64.74 v209.73,64.15 | D1.1 49.37,71.15 R2.2 50.95,70.97 v51.23,71.26 | U18.2 161.75,22.24 | 161.75,22.24 161.21,22.24 160.71,21.73 160.71,20.71 160.2,20.21 159.44,20.21 | 159.44,20.21 158.22,21.42 R78.2 | 159.44,20.21 159.18,20.21 v158.67,19.7 | TP_GND.1 126.01,13.76 v126.67,13.09 | R76.2 138.35,21.22 v138.1,21.48 | U3.2 127.54,57.39 v128.45,58.31 129.2,58.31 130.6,59.71 | D3.1 130.6,59.71 | R43.1 32.72,34.46 v32.44,34.18 | R44.1 39.81,34.42 v40.06,34.18 | C33.2 162.99,23.67 162.99,23 162.23,22.24 161.75,22.24 | C34.2 169.85,25.51 | 169.85,25.51 C36.2 | 169.85,25.51 v169.85,26.56 | K1.2 52.5,38.03 v52.5,39 | U25.3 31.42,10.81 31.67,11.06 31.67,13.06 C41.2 29.43,13.9 v29.39,13.86 | v12.88,14.11 13.29,13.69 C39.2 15.42,12.66 15.42,11.06 15.11,10.75 U23.3
  Top 0.152: R61.1 19.59,15.74 v19.48,15.63 | R60.1 R59.1 14.26,16.14 v14.15,16.14 | R63.1 22.92,16.4 v22.28,16.4 | R10.2 158.18,64.16 v159.69,65.67 | C12.1 151.16,41.9 v151.56,42.3 | R5.2 129.34,63.44 129.34,60.97 130.6,59.71 | Q2.2 131.03,68 v132,68.97
  Top 0.254: U1.1 97.57,68.88 C5.2 v96.7,69.47 v96.7,69.48 | C6.2 96.69,61.85 v95.68,60.85 | C4.2 79.93,61.4 v79.93,64.15 79.93,67.53 C3.2 | C1.2 63.17,61.79 v63.17,64.12 63.17,67.76 C2.2
  Top 0.305: Q4.2 66.52,14.92 v66.47,14.87 | Q3.2 68.72,23.47 v68.25,23
  Top 0.508: D2.1 57.23,62.62 v58.34,62.62 | Q1.2 45.22,66.86 v44.88,67.2
  pour GND: -15.52,81.42 229.84,81.42 230.3,-9.77 -15.06,-9.77
HV+_OUT_OK
  Top 0.152: U24.4 24.31,10.89 | 24.31,10.89 25.91,10.89 27.12,12.1 U25.1 | R88.2 24.31,9.37 24.31,10.89
IM
  Top 0.152: U7.10 208.82,38.13 208.2,38.75 208.2,41.54 218.76,52.1 T1.10
IMD_OK  (via drill 0.3)
  Top 0.152: IMD_OK.2 110.44,37.36 TP_IMD_OK.1 117.91,37.36 119.81,39.26 119.81,51.39 U3.3 114.57,54.85 113.21,56.22 v113.21,56.78 | v157.91,57.04 157.91,62.24 D6.2 165.26,69.59 R11.1
  Top 0.254: J6.7 80.46,53.98 R20.2 115.48,53.98 U3.3
  Bottom 0.152: v113.21,56.78 157.66,56.78 v157.91,57.04
IMD_OK_TEENSY  (via drill 0.25)
  Top 0.152: v154.25,45.35 154.25,48.81 167.31,61.86 167.31,64.64 R12.1 R11.2
  Bottom 0.152: v154.25,45.35 165.83,33.77 A3.D16
INVERTER_24V
  Top 0.508: K1.3 46.3,38.24 39.44,45.1 26.09,45.1 23.11,48.07 J1.1
INVERTER_EN  (via drill 0.25)
  Top 0.152: v54.53,39.26 54.53,37.39 R45.1
  Bottom 0.152: J6.2 58.63,47.13 56.31,47.13 55.33,46.15 55.33,44.31 54.53,43.51 v54.53,39.26
IP
  Top 0.152: U7.11 209.08,38.63 208.71,39 208.71,41.29 215.74,48.32 T1.12
ISO_PACK+
  Top 0.152: R33.1 3.04,31.38 8.4,36.75 J5.1
ISO_PACK-
  Top 0.152: 3.04,25.79 3.04,25.73 4.24,24.52 4.77,24.52 R55.2 | 3.04,25.79 R34.1 | J5.2 10.52,36.9 3.99,30.37 3.99,26.75 3.04,25.79
ISO_TS+
  Top 0.152: R37.1 19.15,29.94 14.91,34.18 14.91,36.72 12.64,38.98 J5.3
ISO_TS-
  Top 0.152: R62.2 22.64,26.44 22.28,26.81 20.75,26.81 19.62,27.94 19.62,28.08 | 19.62,28.08 R38.1 | J5.4 14.76,41.18 17.2,38.75 17.2,34.43 20.37,31.25 20.37,28.83 19.62,28.08
MHS
  Top 0.152: D8.2 185.65,69.87 R15.1 190.15,71.01 210.49,71.01 211.25,70.24 211.25,68.21 209.47,66.43 208.23,66.43 R19.2 206.53,60.64 J2.3
MHS_TEENSY  (via drill 0.25)
  Top 0.152: R15.2 189.01,66.08 R16.1 188.52,66.06 175.43,52.97 v171.88,52.97
  +3V3+5V 0.152: v171.88,52.97 170.91,52 A3.D7
N$1
  Top 0.152: R96.2 108.65,15.52 3.3V.1
N$2
  Top 0.152: R73.2 5V.1
N$3
  Top 0.152: C28.1 65.25,25.1 U15.2 61.07,25.1 59.8,26.37 U15.6 57.77,26.37 56.57,27.57 54.53,27.57 54.03,27.07 R68.1
N$4
  Top 0.152: R24.1 103.68,42.68 105.08,44.08 108.98,44.08 PRECHARGE_OK.2
N$5
  Top 0.152: C17.1 58.25,29.29 U15.5
N$6
  Top 0.152: R68.2 R69.1 56.11,25.1 U15.7
N$7
  Top 0.152: R1.2 45.22,61.9 Q1.1
N$8
  Top 0.152: U3.1 127.81,54.85 R21.2
N$9
  Top 0.152: OKHS.1 R18.2
N$10
  Top 0.152: R37.2 R39.1 24.24,31.64 26.46,31.64 27.39,30.7 27.39,30.18 U9.1
N$11
  Top 0.152: R38.2 22.57,28.11 R40.1 23.48,28.97 25.7,28.97 26.06,29.33 U9.3
N$12
  Top 0.152: R23.1 38.54,36.09 U5.3 37.01,36.07 R44.2
N$13
  Top 0.152: U7.2 204.54,40.63 204.39,40.78 204.39,41.8 204.65,42.05 207.7,42.05 208.19,42.54 R29.1 207.65,43.37 206.81,44.21 204.77,44.21 203.89,45.1 162.48,45.1 160.75,46.83 A3.D11
N$14
  Top 0.152: R74.2 108.63,23.65 12V.1
N$15
  Top 0.152: R79.2 184.33,18.02 185.44,18.02 | U20.2 185.77,18.34 185.44,18.02 | 185.44,18.02 190.21,18.02 U21.1
N$16
  Top 0.152: U2.1 128.27,64 R4.1
N$17
  Top 0.152: R48.2 AMS_OK.1
N$18
  Top 0.152: U27.9 63.6,15.82 | 63.6,15.82 R70.1 | 63.6,15.82 63.6,13.48 R94.1 65.66,12.6 D10.3 85.53,12.62 TP_TSAL_GREEN.1
N$19  (via drill 0.3)
  Top 0.152: U15.3 65.38,26.37 R71.1 65.39,27.95 D9.3 69.19,29.06 R47.1 69.41,28.84 v71.55,28.84 | v87.81,27.83 87.99,27.65 TP_TSAL_RED.1
  Bottom 0.152: v71.55,28.84 86.79,28.84 v87.81,27.83
N$20
  Top 0.152: Q2.3 125.15,67.06 U2.2
N$21
  Top 0.152: R27.1 148.47,44.49 R26.1 148.6,44.26 C12.2
N$22
  Top 0.152: R33.2 R36.1 6.03,28.35 7.29,29.6 9.83,29.6 10.79,28.64 U8.1
N$23
  Top 0.152: R34.2 5.98,25.85 | 5.98,25.85 R35.1 | U8.3 9.49,26.98 9.32,26.81 6.95,26.81 5.98,25.85
N$24
  Top 0.152: TSAL_GREEN.2 R95.2
N$25  (via drill 0.25)
  Top 0.152: A3.D0 187.2,49.42 v176.96,49.42 | v140.39,45.61 140.39,44.59 140.19,44.4 U6.4
  Bottom 0.152: v140.39,45.61 144.2,49.42 v176.96,49.42
N$26
  Top 0.152: U19.6 170.51,20.82 167.97,23.36 U19.1 166.57,23.91 C34.1
N$27
  Top 0.152: R25.2 108.63,37.41 IMD_OK.1
N$28
  Top 0.305: F2.1 74.19,20.61 72.57,22.24 72.57,29.86 64.95,37.48 64.95,46.97 J6.3
N$29  (via drill 0.25)
  Top 0.152: v140.39,48.4 140.19,48.21 U6.1
  Bottom 0.152: v140.39,48.4 142.16,50.18 183.89,50.18 A3.D1
N$30
  Top 0.152: R6.2 130.53,66.05 Q2.1
N$31
  Top 0.305: F1.1 74.19,30.26 67.74,36.72 67.74,47.17 J6.4
N$32
  Top 0.152: R49.2 108.64,28.32 24V.1
N$33
  Top 0.152: R42.2 26.73,36.18 U4.3 28.12,36.2 R22.1
N$34
  Top 0.152: C21.2 148.65,32.57 R50.1 R51.1
N$35
  Top 0.152: R51.2 151.65,36.1 J8.2
N$36
  Top 0.152: U7.16 211.47,41.13 R30.1
N$37
  Top 0.152: R31.1 R30.2 210.27,40.63 U7.15
N$38
  Top 0.152: K1.1 54.04,35.19 R45.2
N$39
  Top 0.152: C7.1 231.14,50.04 T1.11
N$41
  Top 0.152: U25.4 34.97,10.8 R89.1
N$43
  Top 0.152: U7.3 204.28,40.13 203.89,40.53 203.89,42.3 204.95,43.37 | 204.95,43.37 R28.1 | A3.D12 158.22,46.57 160.45,44.34 203.98,44.34 204.95,43.37
N$44
  Top 0.152: A3.D13 166.06,40.53 203.38,40.53 204.27,39.63 U7.4
N$45
  Top 0.152: C36.1 173.02,24.04 U19.8
N$46
  Top 0.152: R72.2 81.14,26.18 TSAL_RED.2
N$47
  Top 0.152: R80.1 185.53,26.73 WATCHDOG.2
N$48
  Top 0.152: R78.1 R77.2 160.03,22.99 U18.1
N$49
  Top 0.152: R89.2 40.44,17.93 U14.1
N$50
  Top 0.152: U31.6 170.47,8.16 167.93,10.7 U31.1 166.64,11.26 C50.1
N$51
  Top 0.152: C51.1 172.96,11.26 U31.8
N$52
  Top 0.152: R100.1 R99.2 159.87,10.97 U30.1
N$53
  Top 0.152: C46.1 148.6,11.51 U29.1 149.82,10.29 149.83,10.29 151.71,8.41 U29.6
N$54
  Top 0.152: C47.1 154.37,13.19 U29.8
N$55
  Top 0.152: R98.1 R97.2 141.81,10.46 U28.1
N$56
  Top 0.152: C30.1 148.49,24.19 U17.1 149.91,23.63 152.45,21.09 U17.6
N$57
  Top 0.152: C32.1 154.94,24.32 U17.8
N$58
  Top 0.152: R76.1 R75.2 141.59,22.76 U16.1
N$59
  Top 0.152: R82.1 201.63,26.64 TEENSY_OK.2
N$60
  Top 0.152: R71.2 68.54,26.38 Q3.1
N$61
  Top 0.152: R70.2 68.03,16.85 Q4.1
OKHS  (via drill 0.35)
  Top 0.152: OKHS.2 209.14,68.13 208.2,67.2 205.77,67.2 R17.2 205.16,62.89 J2.2 | R21.1 131.24,54.87 v131.24,55
  Bottom 0.152: v131.24,55 179.76,55 186.36,61.61 202.56,61.61 J2.2
PACK+_BUFFER
  Top 0.152: U16.3 U16.4 145.91,21.48 146.99,21.48 147.88,22.36 U17.2
PACK+_FILTERED  (via drill 0.25)
  Top 0.152: U17.5 155.75,19.82 v155.88,19.95
  Bottom 0.152: v155.88,19.95 168.38,32.45 A3.D17
PACK+_OUT  (via drill 0.25)
  Top 0.152: R35.2 9.37,25.82 U8.4 9.49,24.35 R57.2 | R57.2 9.28,22.36 8.6,21.68 6.32,21.68 | 6.32,21.68 5.16,20.53 U11.1 | U22.3 5.14,6.37 4.24,5.47 1.96,5.47 1.19,6.24 1.19,20.21 2.67,21.68 6.32,21.68 | R57.2 11.5,21.93 R58.2 v15.05,24.02 | R75.1 129.72,32.91 129.72,33.92 127.94,35.7 123.11,35.7 122.61,36.21 122.61,39.29 PACK+_OUT_TEST.1 125.77,40.41 v125.91,40.27
  +3V3+5V 0.152: v15.05,24.02 47.93,24.02 51.74,20.21 96.19,20.21 98.98,23 v98.98,26.81
  Bottom 0.152: v98.98,26.81 99.49,27.32 115.24,27.32 125.91,37.99 v125.91,40.27
PRECHARGE+_OUT_OK
  Top 0.152: R87.2 16.25,9.36 U23.4 17.76,10.75 21.51,7 25.32,7 29.78,11.45 U25.2
PRECHARGE_OK  (via drill 0.25, 0.35, 0.41)
  Top 0.152: 42.85,40.53 v39.29,44.08 | v39.29,46.37 39.29,57.68 R1.1 44.6,60.08 45.64,60.08 48.18,62.62 48.18,64.15 | 48.18,64.15 55.3,71.26 170.19,71.26 D7.3 173.55,68.02 R14.1 | 48.18,64.15 46.64,65.69 D1.3 49.42,69.14 R2.1 | PRECHARGE_OK_TEST.1 115.43,42.49 113.21,40.27 107.11,40.27 | R24.2 105.38,42.01 107.11,40.27 | 107.11,40.27 72.82,40.27 v72.31,39.76
  Top 0.254: U14.3 43,32.14 43.1,32.14 | 43.1,32.14 43.1,40.27 42.85,40.53 v41.07,40.53 | v44.37,32.14 43.1,32.14
  Bottom 0.152: v39.29,44.08 v39.29,46.37 | v72.31,39.76 64.69,32.14 v44.37,32.14
  Bottom 0.254: v41.07,40.53 19.74,40.53 17.96,42.3 15.93,42.3 14.36,40.74 14.36,39.29 J5.7
PRECHARGE_OK_TEENSY  (via drill 0.25)
  Top 0.152: R14.2 178.44,65.49 R13.1 165.42,52.46 v165.28,52.46
  +3V3+5V 0.152: A3.D15 167.06,36.44 167.06,50.69 v165.28,52.46
PRECHARGE_REACHED
  Top 0.152: U12.4 19,19.28 R61.2 18.47,17.57 18.47,13.09 20.02,11.54 U24.2
SHDN
  Top 0.508: J1.8 28.37,49.08 30.83,49.08 32.69,50.94 32.69,53.24 J1.10
  +3V3+5V 0.508: J1.10 31.59,56.61 30.4,57.8 26.09,57.8 11.05,42.76 11.05,40.57 12.64,38.98 J5.6
  +3V3+5V 0.813: J6.5 66.72,51.19 34.73,51.19 J1.10
TD+
  Top 0.152: T1.1 250.94,48.32 251.58,47.68 TD+.1 253.36,48.4 254.69,48.4 | J4.1 258.24,50.99 258.24,49.42 257.23,48.4 254.69,48.4 | R32.2 254.69,45.45 254.69,48.4
TD-
  Top 0.152: J4.2 251.63,54.61 TD-.1 | TD-.1 246.62,52.1 T1.3 | TD-.1 253.98,54.75 257.48,54.75 260.02,52.21 260.02,46.11 258.79,44.88 R32.1
TEENSY_OK  (via drill 0.25)
  Top 0.152: v186.11,30.11 192.51,30.11 R82.2 195.98,26.08 v197.28,24.78 | U21.3 192.88,15.6 R101.2 193.9,15.46 v193.98,15.38
  Bottom 0.152: v186.11,30.11 184.84,31.38 184.84,36.54 A3.D6 | v193.98,15.38 195.5,15.38 197.28,17.16 v197.28,24.78
TIMER_EN  (via drill 0.25)
  Top 0.152: v61.65,26.05 61.65,27.06 62.15,27.57 63.39,27.57 U15.4 63.82,28.01 R46.2 | v61.65,24.02 61.65,17.12 U27.10
  Bottom 0.152: v61.65,26.05 v61.65,24.02
TS+_OUT  (via drill 0.25)
  Top 0.152: R40.2 24.42,27.95 U9.4 26.06,26.32 R66.2 | R66.2 24.02,24.27 16.43,24.27 15.93,23.76 15.93,22.53 U12.1 | U13.3 26.14,17.21 26.34,17.41 26.34,25.81 R66.2 | v35.74,16.4 35.74,16.41 R66.2 | v38.28,13.86 38.28,11.06 | 38.28,11.06 38.79,10.55 41.44,10.55 U26.1 | R77.1 158.22,26 155.63,28.59 137.59,28.59 128.81,37.37 TS+_OUT_TEST.1 125.82,37.22 v123.37,37.22 | v97.46,27.06 92.63,22.24 92.63,10.05 89.59,7 40.31,7 38.28,9.03 38.28,11.06
  Bottom 0.152: v35.74,16.4 v38.28,13.86 | v123.37,37.22 114.22,28.08 98.48,28.08 v97.46,27.06
TS+_OUT_BUFFER
  Top 0.152: U19.2 165.38,22.09 164.98,21.69 U18.4 U18.3
TS+_OUT_FILTERED  (via drill 0.25)
  Top 0.152: U19.5 173,20.21 174.68,21.88 v174.68,28.33
  Bottom 0.152: v174.68,28.33 170.91,32.09 A3.D18
TS+_OUT_OV_OK
  Top 0.152: R67.2 29.07,17.21 U13.4 27.43,16.47 26.59,15.63 21.51,15.63 20.75,14.87 20.75,13.52 U24.1
TSAL_GREEN
  Top 0.152: F2.2 77.23,14.95 TSAL_GREEN.1
  Top 0.305: Q4.3 71.01,14.95 F2.2
TSAL_RED  (via drill 0.41)
  Top 0.152: F1.2 75.57,23 79.68,23 80.31,23.63 80.31,25.41 79.5,26.23 TSAL_RED.1
  Top 0.305: Q3.3 70.73,23.44 v71.42,22.75 | v73.84,22.75 74.19,23.1 F1.2
  Bottom 0.305: v71.42,22.75 v73.84,22.75
V_PACK_REF_OV_OK  (via drill 0.25)
  Top 0.152: U22.4 6.56,7.47 6.27,7.76 6.27,9.05 R86.2 8.16,10.27 11.83,10.27 v12.12,10.55 | v12.12,12.08 14.03,12.08 U23.1
  Bottom 0.152: v12.12,10.55 v12.12,12.08
V_PACK_REF_UV_OK
  Top 0.152: U11.4 7.36,17.26 R56.2 8.24,16.73 10.85,14.12 10.85,12.16 11.61,11.4 U23.2
WATCHDOG_INPUT  (via drill 0.25)
  Top 0.152: v184.84,37.99 184.84,30.87 183.79,29.83 R80.2 187.34,23.14 WATCHDOG_INPUT.1 192.11,23.14 R81.2 193.96,19.87 U21.4
  Bottom 0.152: v184.84,37.99 184.84,38.49 175.99,47.33 A3.D5

## Text on the board
tPlace: Accumulator Control Unit Rev4 / Designed by Liwei Sun